# EAGLE design master_board_labrob (EAGLE 7.5.0)
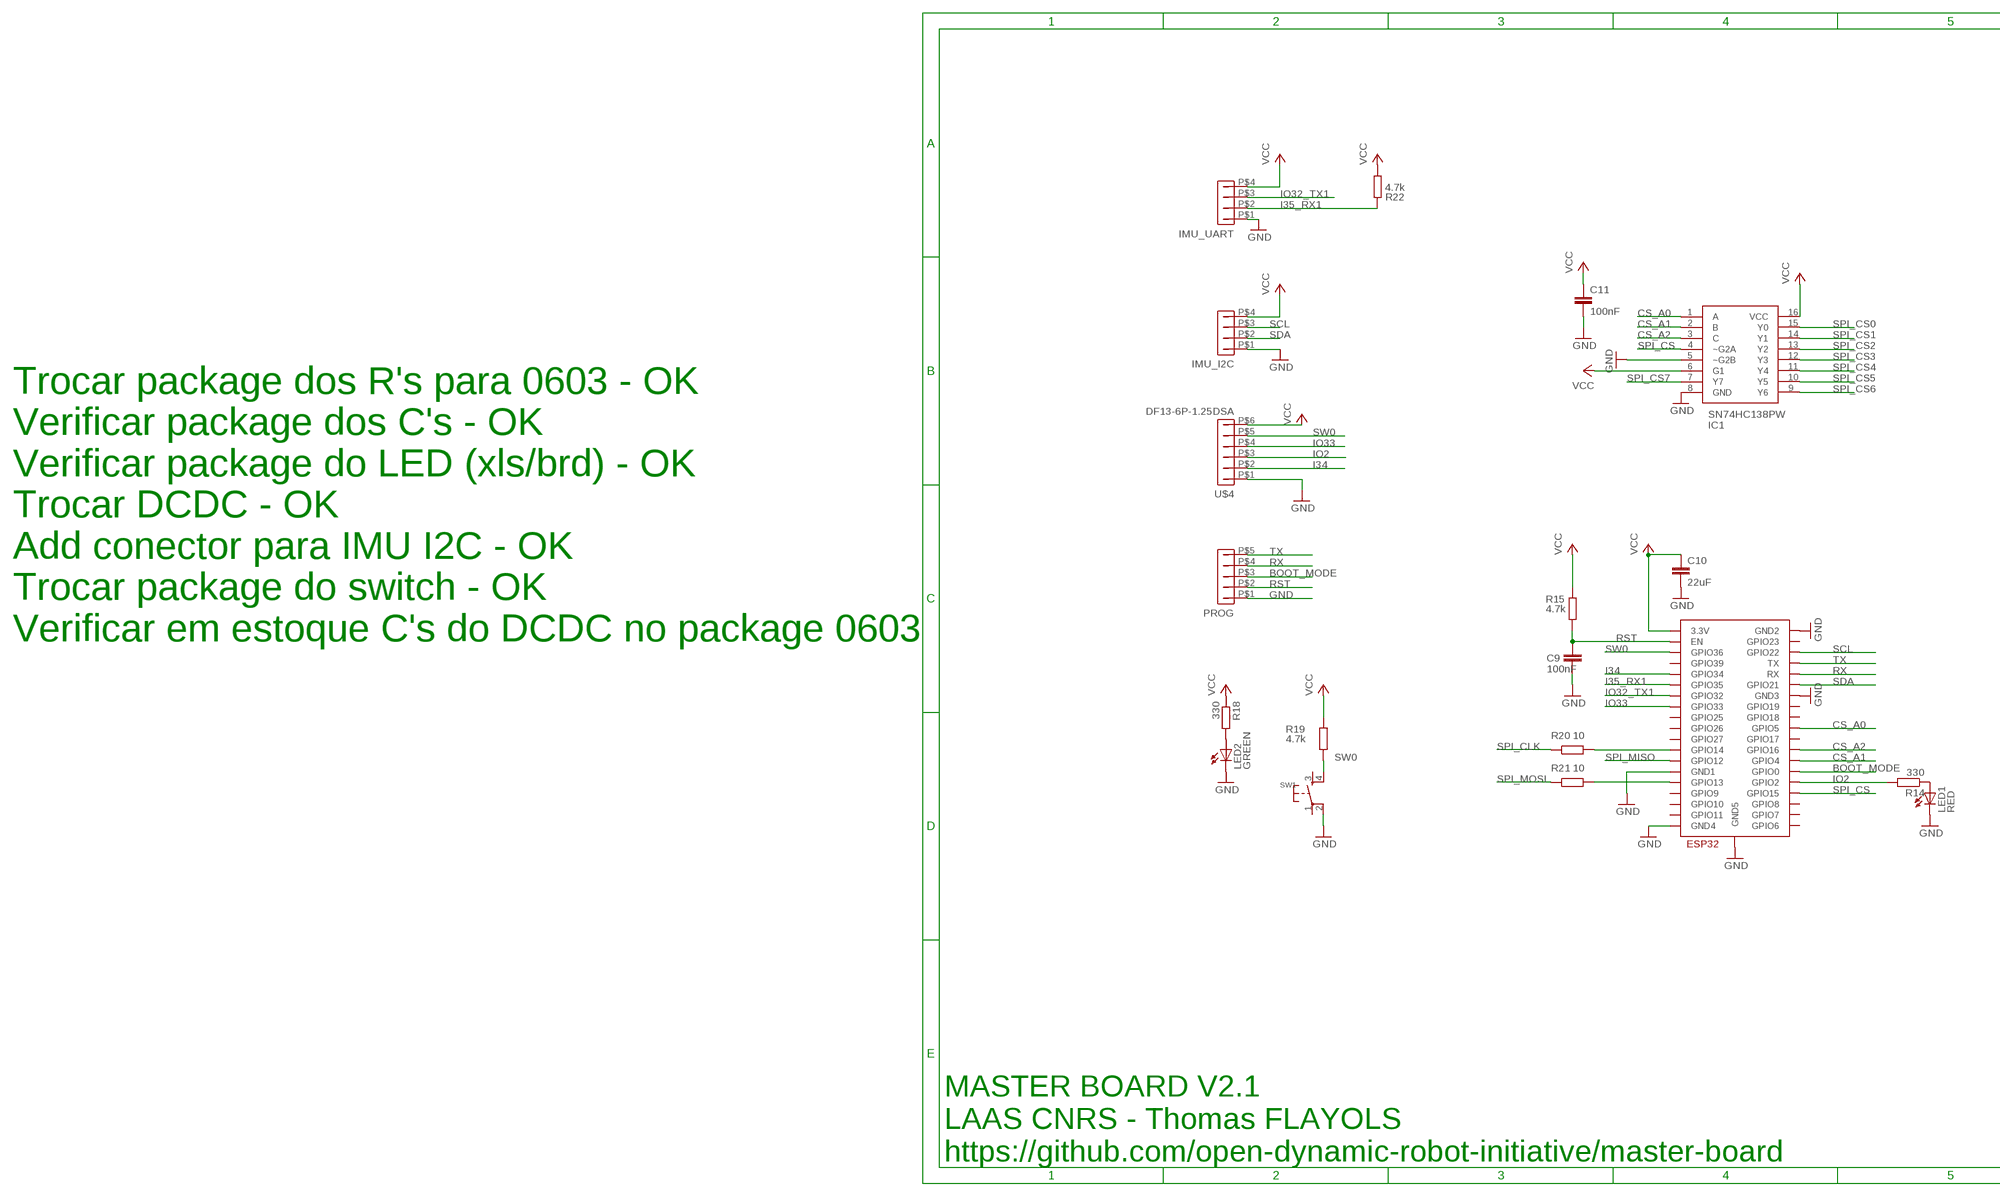
[diagram p0: schematic, sheet 1, part 1 of 2]
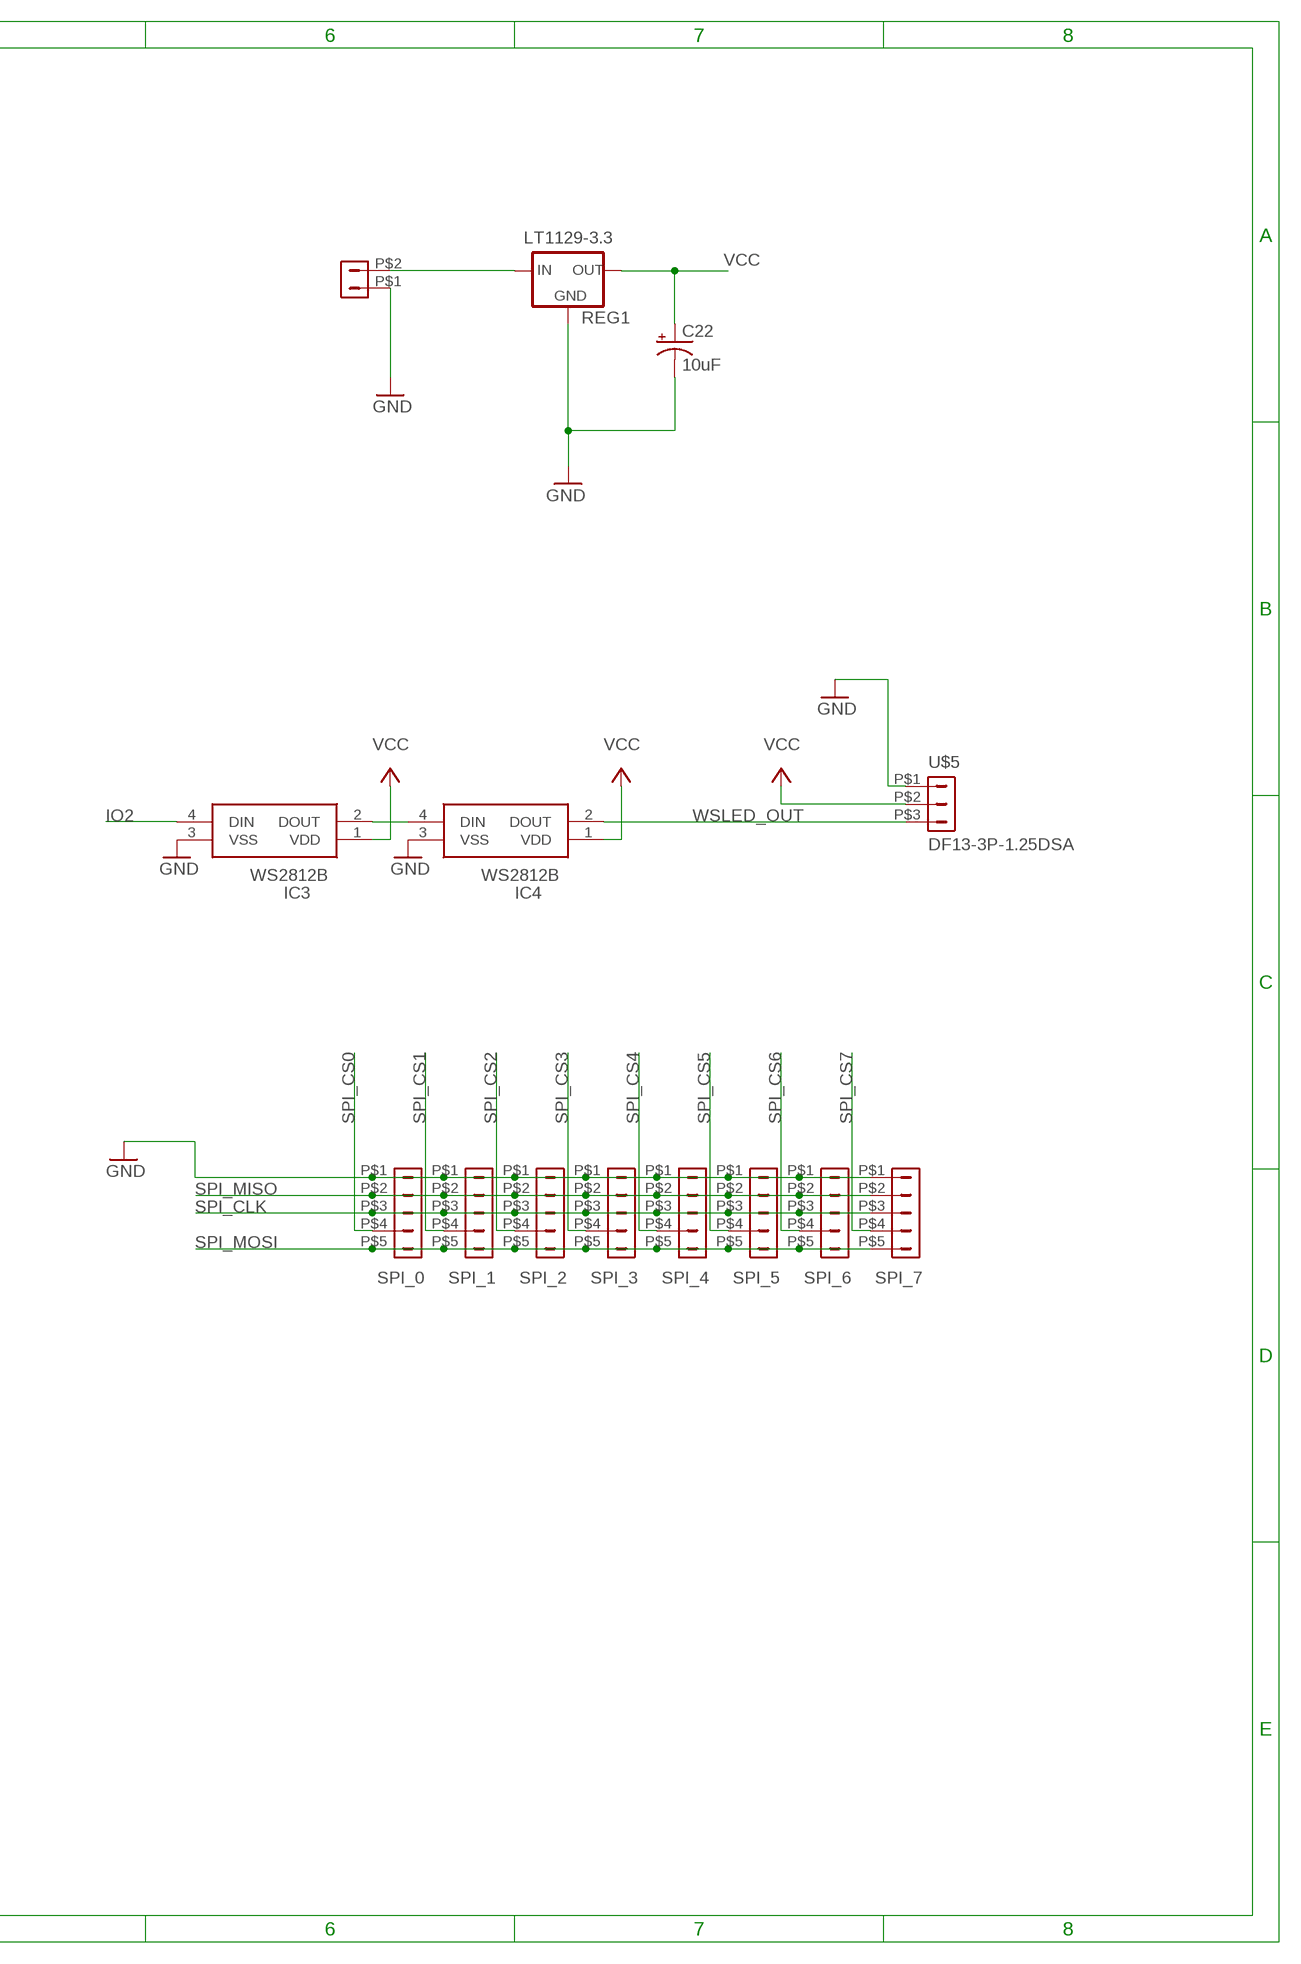
[diagram p1: schematic, sheet 1, part 2 of 2]

## Parts
C9  100nF  C-EUC0603  [C0603]
C10  22uF  C-EUC0805  [C0805]
C11  100nF  C-EUC0603  [C0603]
C22  10uF  CPOL-USC/6032-28R  [C/6032-28R]
IC1  SN74HC138PW  [SOP65P640X120-16N]
IC3  WS2812B  [WS2812B]
IC4  WS2812B  [WS2812B]
IMU_I2C  DF13-4P-1.25DSA  [DF13-4P-1.25DSA]
IMU_UART  DF13-4P-1.25DSA  [DF13-4P-1.25DSA]
LED1  RED  LEDCHIPLED_0603  [CHIPLED_0603]
LED2  GREEN  LEDCHIPLED_0603  [CHIPLED_0603]
POWER  DF13-2P-1.25DSA  [DF13-2P-1.25DSA]
PROG  DF13-5P-1.25DSA  [DF13-5P-1.25DSA]
R14  330  R-EU_R0603  [R0603]
R15  4.7k  R-EU_R0603  [R0603]
R18  330  R-EU_R0603  [R0603]
R19  4.7k  R-EU_R0603  [R0603]
R20  10  R-EU_R0603  [R0603]
R21  10  R-EU_R0603  [R0603]
R22  4.7k  R-EU_R0603  [R0603]
REG1  LT1129-3.3  [SOT223]
SPI_0  DF13-5P-1.25DSA  [DF13-5P-1.25DSA]
SPI_1  DF13-5P-1.25DSA  [DF13-5P-1.25DSA]
SPI_2  DF13-5P-1.25DSA  [DF13-5P-1.25DSA]
SPI_3  DF13-5P-1.25DSA  [DF13-5P-1.25DSA]
SPI_4  DF13-5P-1.25DSA  [DF13-5P-1.25DSA]
SPI_5  DF13-5P-1.25DSA  [DF13-5P-1.25DSA]
SPI_6  DF13-5P-1.25DSA  [DF13-5P-1.25DSA]
SPI_7  DF13-5P-1.25DSA  [DF13-5P-1.25DSA]
SW1  B3U-1000P-2P-SMD  DTSM-6  [DTSM-6]
U$1  ESP32-WROOM  [ESP32-WROOM]
U$4  DF13-6P-1.25DSA  [DF13-6P-1.25DSA]
U$5  DF13-3P-1.25DSA  [DF13-3P-1.25DSA]

## Nets
BOOT_MODE: PROG.P$3 U$1.IO0(GPIO0)
CS_A0: IC1.1(A) U$1.IO5(GPIO5)
CS_A1: IC1.2(B) U$1.IO4(GPIO4)
CS_A2: IC1.3(C) U$1.IO16(GPIO16)
GND: C9.2 C10.2 C11.2 C22.- IC1.5(~G2B) IC1.8(GND) IC3.3(VSS) IC4.3(VSS) IMU_I2C.P$1 IMU_UART.P$1 LED1.C LED2.C POWER.P$1 PROG.P$1 REG1.2(GND) REG1.TAB(GND) SPI_0.P$1 SPI_1.P$1 SPI_2.P$1 SPI_3.P$1 SPI_4.P$1 SPI_5.P$1 SPI_6.P$1 SPI_7.P$1 SW1.2 U$1.GND1 U$1.GND2 U$1.GND3 U$1.GND4 U$1.GND5 U$4.P$1 U$5.P$1
I34: U$1.IO34(GPIO34) U$4.P$2
I35_RX1: IMU_UART.P$2 R22.2 U$1.IO35(GPIO35)
IO2: IC3.4(DIN) R14.2 U$1.IO2(GPIO2) U$4.P$3
IO32_TX1: IMU_UART.P$3 U$1.IO32(GPIO32)
IO33: U$1.IO33(GPIO33) U$4.P$4
N$1: IC3.2(DOUT) IC4.4(DIN)
N$3: POWER.P$2 REG1.1(IN)
N$16: LED1.A R14.1
N$17: R21.2 U$1.IO13(GPIO13)
N$20: LED2.A R18.2
N$21: R20.2 U$1.IO14(GPIO14)
RST: C9.1 PROG.P$2 R15.1 U$1.EN
RX: PROG.P$4 U$1.RX
SCL: IMU_I2C.P$3 U$1.IO22(GPIO22)
SDA: IMU_I2C.P$2 U$1.IO21(GPIO21)
SPI_CLK: R20.1 SPI_0.P$3 SPI_1.P$3 SPI_2.P$3 SPI_3.P$3 SPI_4.P$3 SPI_5.P$3 SPI_6.P$3 SPI_7.P$3
SPI_CS: IC1.4(~G2A) U$1.IO15(GPIO15)
SPI_CS0: IC1.15(Y0) SPI_0.P$4
SPI_CS1: IC1.14(Y1) SPI_1.P$4
SPI_CS2: IC1.13(Y2) SPI_2.P$4
SPI_CS3: IC1.12(Y3) SPI_3.P$4
SPI_CS4: IC1.11(Y4) SPI_4.P$4
SPI_CS5: IC1.10(Y5) SPI_5.P$4
SPI_CS6: IC1.9(Y6) SPI_6.P$4
SPI_CS7: IC1.7(Y7) SPI_7.P$4
SPI_MISO: SPI_0.P$2 SPI_1.P$2 SPI_2.P$2 SPI_3.P$2 SPI_4.P$2 SPI_5.P$2 SPI_6.P$2 SPI_7.P$2 U$1.IO12(GPIO12)
SPI_MOSI: R21.1 SPI_0.P$5 SPI_1.P$5 SPI_2.P$5 SPI_3.P$5 SPI_4.P$5 SPI_5.P$5 SPI_6.P$5 SPI_7.P$5
SW0: R19.1 SW1.4 U$1.SENSOR_VP(GPIO36) U$4.P$5
TX: PROG.P$5 U$1.TX
VCC [power]: C10.1 C11.1 C22.+ IC1.6(G1) IC1.16(VCC) IC3.1(VDD) IC4.1(VDD) IMU_I2C.P$4 IMU_UART.P$4 R15.2 R18.1 R19.2 R22.1 REG1.3(OUT) U$1.3V3(3.3V) U$4.P$6 U$5.P$2
WSLED_OUT: IC4.2(DOUT) U$5.P$3
Unconnected: SW1.1 SW1.3 U$1.CLK(GPIO6) U$1.CMD(GPIO11) U$1.IO17(GPIO17) U$1.IO18(GPIO18) U$1.IO19(GPIO19) U$1.IO23(GPIO23) U$1.IO25(GPIO25) U$1.IO26(GPIO26) U$1.IO27(GPIO27) U$1.SD0(GPIO7) U$1.SD1(GPIO8) U$1.SD2(GPIO9) U$1.SD3(GPIO10) U$1.SENSOR_VN(GPIO39)

## Notes on the sheet
- Trocar package dos R's para 0603 - OK
  Verificar package dos C's - OK
  Verificar package do LED (xls/brd) - OK
  Trocar DCDC - OK
  Add conector para IMU I2C - OK
  Trocar package do switch - OK
  Verificar em estoque C's do DCDC no package 0603
- MASTER BOARD V2.1
  LAAS CNRS - Thomas FLAYOLS
  https://github.com/open-dynamic-robot-initiative/master-board

## Library data of the parts
C9 C11 = rcl:C-EU: CAPACITOR, European symbol; MANUFACTURER_PART_NUMBER: CPL-CAP-X7R-0402-100NF-16V
C10 = rcl:C-EU: CAPACITOR, European symbol; MANUFACTURER_PART_NUMBER: CPL-CAP-X5R-0805-22UF-6.3V
C22 = rcl:CPOL-US: POLARIZED CAPACITOR, American symbol
IC1 = SamacSys_Parts:SN74HC138PW: Texas Instruments SN74HC138PW, Decoder, Demultiplexer, 1-of-8, Inverting, 2 6 V, 16-Pin TSSOP Source: Datasheet <http://www.ti.com/lit/gpn/sn74hc138>; DESCRIPTION: Texas Instruments SN74HC138PW, Decoder, Demultiplexer, 1-of-8, Inverting, 2 6 V, 16-Pin TSSOP; HEIGHT: mm; MANUFACTURER_NAME: Texas Instruments; MANUFACTURER_PART_NUMBER: SN74HC138PW; RS_PART_NUMBER: 6631928; RS_PRICE-STOCK: https://uk.rs-online.com/web/p/products/6631928
IC3 IC4 = WS2812B:WS2812B: Intelligent control LED integrated light source Source: Datasheet <https://www.adafruit.com/datasheets/WS2812B.pdf>; DESCRIPTION: Intelligent control LED integrated light source; HEIGHT: mm; MANUFACTURER_NAME: Worldsemi; MANUFACTURER_PART_NUMBER: WS2812B
IMU_I2C IMU_UART = con-hirose-df13:DF13-4P-1.25: DF13-4P 1.25mm Pitch Miniature Crimping Connector.; MANUFACTURER_PART_NUMBER: DF13-4P-1.25DSA
LED1 = led:LED: LED OSRAM: - CHIPLED LG R971, LG N971, LY N971, LG Q971, LY Q971, LO R971, LY R971 LH N974, LH R974 LS Q976, LO Q976, LY Q976 LO Q996 - Hyper CHIPLED LW Q18S LB Q993, LB Q99A, LB R99A - SideLED LS A670, LO A670, LY A670, LG A670, LP A670 LB A673, LV A673, LT A673, LW A673 LH A674 LY A675 LS A676, LA A676, LO A676, LY A676, LW A676 LS A679, LY A679, LG A679 - Hyper Micro SIDELED® LS Y876, LA Y876, LO Y876, LY Y876 LT Y87S - SmartLED LW L88C, LW L88S LB L89C, LB L89S, LG L890 LS L89K, LO L89K, LY L89K LS L896, LA L896, LO L896, LY L896 - TOPLED LS T670, LO T670, LY T670, LG T670, LP T670 LSG T670, LSP T670, LSY T670, LOP T670, LYG T670 LG T671, LOG T671, LSG T671 LB T673, LV T673, LT T673, LW T673 LH T674 LS T676, LA T676, LO T676, LY T676, LB T676, LH T676, LSB T676, LW T676 LB T67C, LV T67C, LT T67C, LS T67K, LO T67K, LY T67K, LW E67C LS E67B, LA E67B, LO E67B, LY E67B, LB E67C, LV E67C, LT E67C LW T67C LS T679, LY T679, LG T679 LS T770, LO T770, LY T770, LG T770, LP T770 LB T773, LV T773, LT T773, LW T773 LH T774 LS E675, LA E675, LY E675, LS T675 LS T776, LA T776, LO T776, LY T776, LB T776 LHGB T686 LT T68C, LB T68C - Hyper Mini TOPLED® LB M676 - Mini TOPLED Santana® LG M470 LS M47K, LO M47K, LY M47K Source: http://www.osram.convergy.de LUXEON: - LUMILED® LXK2-PW12-R00, LXK2-PW12-S00, LXK2-PW14-U00, LXK2-PW14-V00 LXK2-PM12-R00, LXK2-PM12-S00, LXK2-PM14-U00 LXK2-PE12-Q00, LXK2-PE12-R00, LXK2-PE12-S00, LXK2-PE14-T00, LXK2-PE14-U00 LXK2-PB12-K00, LXK2-PB12-L00, LXK2-PB12-M00, LXK2-PB14-N00, LXK2-PB14-P00, LXK2-PB14-Q00 LXK2-PR12-L00, LXK2-PR12-M00, LXK2-PR14-Q00, LXK2-PR14-R00 LXK2-PD12-Q00, LXK2-PD12-R00, LXK2-PD12-S00 LXK2-PH12-R00, LXK2-PH12-S00 LXK2-PL12-P00, LXK2-PL12-Q00, LXK2-PL12-R00 Source: www.luxeon.com KINGBRIGHT: KA-3528ASYC Source: www.kingbright.com; MANUFACTURER_PART_NUMBER: CPL-LED-0603-RED
LED2 = led:LED: LED OSRAM: - CHIPLED LG R971, LG N971, LY N971, LG Q971, LY Q971, LO R971, LY R971 LH N974, LH R974 LS Q976, LO Q976, LY Q976 LO Q996 - Hyper CHIPLED LW Q18S LB Q993, LB Q99A, LB R99A - SideLED LS A670, LO A670, LY A670, LG A670, LP A670 LB A673, LV A673, LT A673, LW A673 LH A674 LY A675 LS A676, LA A676, LO A676, LY A676, LW A676 LS A679, LY A679, LG A679 - Hyper Micro SIDELED® LS Y876, LA Y876, LO Y876, LY Y876 LT Y87S - SmartLED LW L88C, LW L88S LB L89C, LB L89S, LG L890 LS L89K, LO L89K, LY L89K LS L896, LA L896, LO L896, LY L896 - TOPLED LS T670, LO T670, LY T670, LG T670, LP T670 LSG T670, LSP T670, LSY T670, LOP T670, LYG T670 LG T671, LOG T671, LSG T671 LB T673, LV T673, LT T673, LW T673 LH T674 LS T676, LA T676, LO T676, LY T676, LB T676, LH T676, LSB T676, LW T676 LB T67C, LV T67C, LT T67C, LS T67K, LO T67K, LY T67K, LW E67C LS E67B, LA E67B, LO E67B, LY E67B, LB E67C, LV E67C, LT E67C LW T67C LS T679, LY T679, LG T679 LS T770, LO T770, LY T770, LG T770, LP T770 LB T773, LV T773, LT T773, LW T773 LH T774 LS E675, LA E675, LY E675, LS T675 LS T776, LA T776, LO T776, LY T776, LB T776 LHGB T686 LT T68C, LB T68C - Hyper Mini TOPLED® LB M676 - Mini TOPLED Santana® LG M470 LS M47K, LO M47K, LY M47K Source: http://www.osram.convergy.de LUXEON: - LUMILED® LXK2-PW12-R00, LXK2-PW12-S00, LXK2-PW14-U00, LXK2-PW14-V00 LXK2-PM12-R00, LXK2-PM12-S00, LXK2-PM14-U00 LXK2-PE12-Q00, LXK2-PE12-R00, LXK2-PE12-S00, LXK2-PE14-T00, LXK2-PE14-U00 LXK2-PB12-K00, LXK2-PB12-L00, LXK2-PB12-M00, LXK2-PB14-N00, LXK2-PB14-P00, LXK2-PB14-Q00 LXK2-PR12-L00, LXK2-PR12-M00, LXK2-PR14-Q00, LXK2-PR14-R00 LXK2-PD12-Q00, LXK2-PD12-R00, LXK2-PD12-S00 LXK2-PH12-R00, LXK2-PH12-S00 LXK2-PL12-P00, LXK2-PL12-Q00, LXK2-PL12-R00 Source: www.luxeon.com KINGBRIGHT: KA-3528ASYC Source: www.kingbright.com; MANUFACTURER_PART_NUMBER: CPL-LED-0603-GREEN
POWER = con-hirose-df13:DF13-2P-1.25: DF13-2P 1.25mm Pitch Miniature Crimping Connector.; MANUFACTURER_PART_NUMBER: DF13-3P-1.25DSA
PROG SPI_0 SPI_1-SPI_7 = con-hirose-df13:DF13-5P-1.25: DF13-5P 1.25mm Pitch Miniature Crimping Connector.; MANUFACTURER_PART_NUMBER: DF13-5P-1.25DSA
R14 R18 = rcl:R-EU_: RESISTOR, European symbol; MANUFACTURER_PART_NUMBER: RC0402JR-13330RL
R15 R19 R22 = rcl:R-EU_: RESISTOR, European symbol; MANUFACTURER_PART_NUMBER: CPL-RES-0402-4.7K-0.063W
R20 R21 = rcl:R-EU_: RESISTOR, European symbol; MANUFACTURER_PART_NUMBER: CPL-RES-0402-10-0.063W
REG1 = v-reg-linear:LT1129-3.3
SW1 = switch-tact:DTSM-6; MANUFACTURER_PART_NUMBER: B3U-1000P
U$1 = ESP32:ESP32-WROOM; MANUFACTURER_PART_NUMBER: ESP32-WROOM-32D
U$4 = con-hirose-df13:DF13-6P-1.25: DF13-6P 1.25mm Pitch Miniature Crimping Connector.; MANUFACTURER_PART_NUMBER: DF13-6P-1.25DSA
U$5 = con-hirose-df13:DF13-3P-1.25: DF13-3P 1.25mm Pitch Miniature Crimping Connector.; MANUFACTURER_PART_NUMBER: DF13-3P-1.25DSA

## Net classes
1 power: width 0.406 mm

## Board
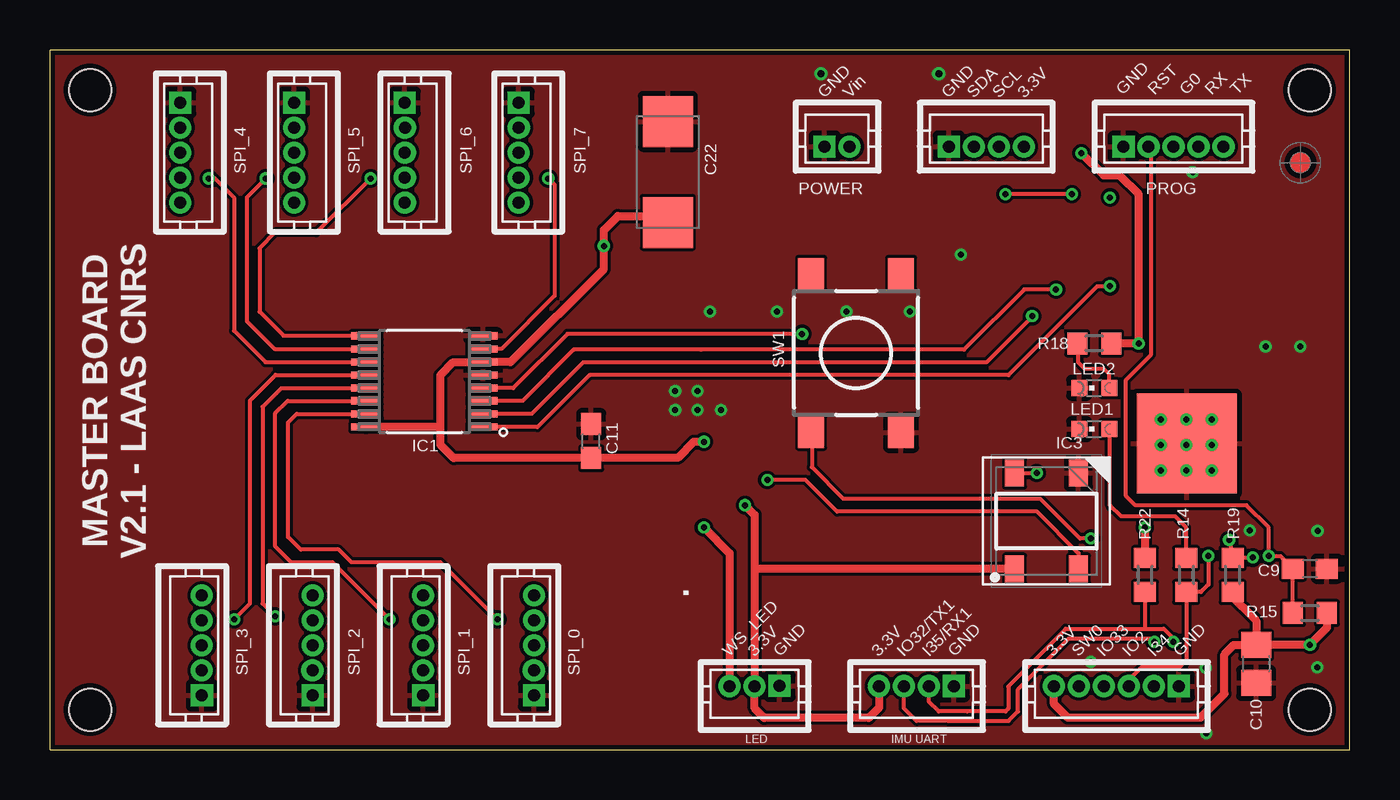
[diagram p2: board, top side]
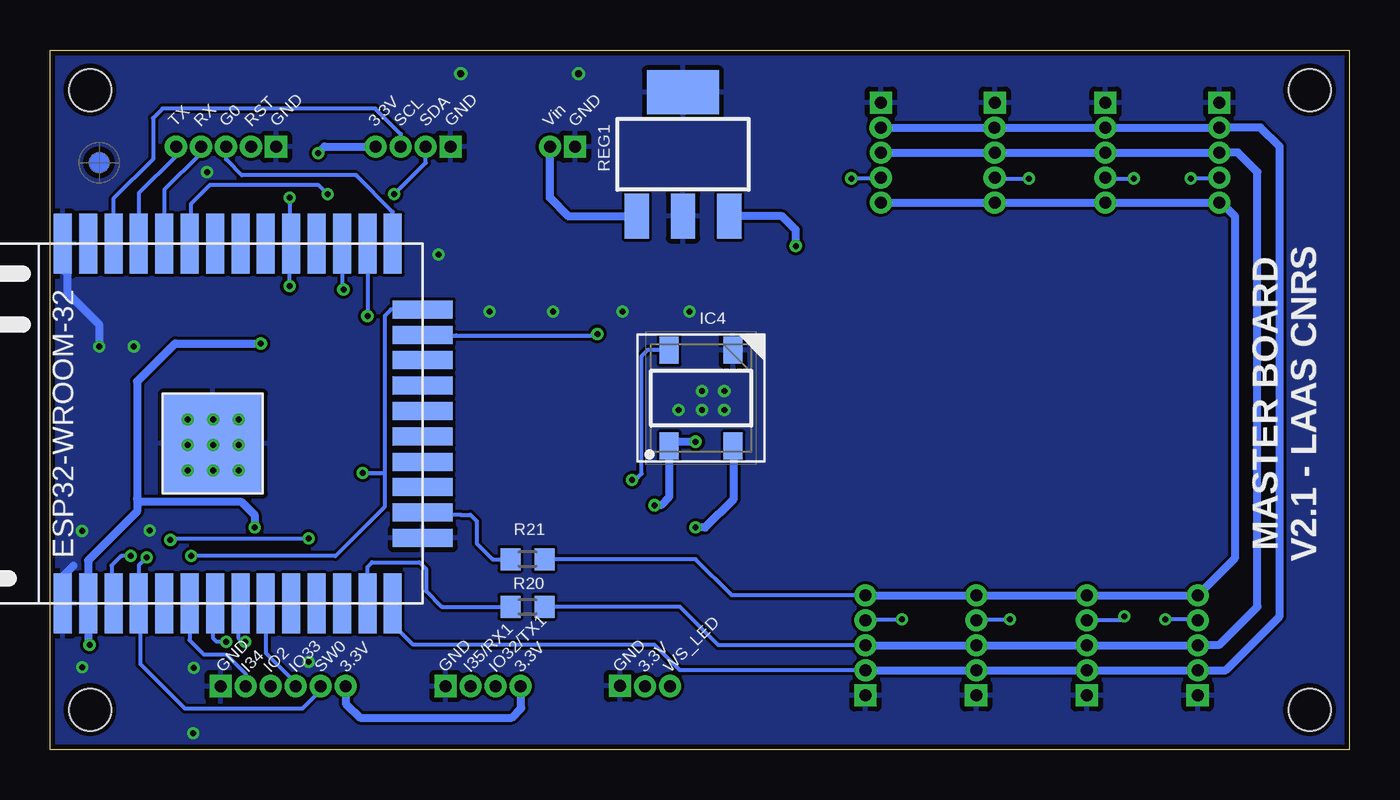
[diagram p3: board, bottom side, seen from below]

Size 65 x 35 mm. Coordinates in mm from the lower left corner, seen from the top.
Outline: 0,35 65,35 65,0 0,0 0,35
Copper layers (1*16): Top 0.035mm / dielectric 1.5mm / Bottom 0.035mm
Design rules "SeeedStudio": minimum track width 6mil, minimum drill 12mil, track to track 6mil, track to pad 6mil, pad to pad 6mil, via to via 6mil, smd to smd 0mil, copper to edge 10mil, drill to drill 10mil, minimum pad ring 10mil, minimum via ring 6mil, stop-mask expansion 2mil, vias tented up to drill 100mil, thermal gap 10mil
Holes 2.1 mm at 2,33 2,2 63,2 63,33

### Footprints (pad centres in the part's own frame; a part is rotated, then mirrored left to right if it is on the bottom)
C0603 = smd 1.1 x 1: 1 -0.85,0; 2 0.85,0
C0805 = smd 1.3 x 1.5: 1 -0.95,0; 2 0.95,0
C/6032-28R = smd 2.55 x 2.5: + 2.525,0; - -2.525,0
SOP65P640X120-16N = smd 1.473 x 0.356: 1 -2.921,2.286; 2 -2.921,1.626; 3 -2.921,0.965; 4 -2.921,0.33; 5 -2.921,-0.33; 6 -2.921,-0.965; 7 -2.921,-1.626; 8 -2.921,-2.286; 9 2.921,-2.286; 10 2.921,-1.626; 11 2.921,-0.965; 12 2.921,-0.33; 13 2.921,0.33; 14 2.921,0.965; 15 2.921,1.626; 16 2.921,2.286
WS2812B = smd 1.35 x 0.95: 1 -2.4,1.6; 2 -2.4,-1.6; 3 2.4,-1.6; 4 2.4,1.6
DF13-4P-1.25DSA = drill 0.6 pad 1.016 square: P$1 1.875,0 | drill 0.6 pad 1.016: P$2 0.625,0; P$3 -0.625,0; P$4 -1.875,0
CHIPLED_0603 = smd 0.8 x 0.8: A 0,-0.75; C 0,0.75
DF13-2P-1.25DSA = drill 0.6 pad 1.016 square: P$1 0.625,0 | drill 0.6 pad 1.016: P$2 -0.625,0
DF13-5P-1.25DSA = drill 0.6 pad 1.016 square: P$1 2.5,0.005 | drill 0.6 pad 1.016: P$2 1.25,-0.005; P$3 0,0; P$4 -1.25,0; P$5 -2.5,0
R0603 = smd 1 x 1.1: 1 -0.85,0; 2 0.85,0
SOT223 = smd 1.219 x 2.235: 1 -2.311,-3.099; 2 0,-3.099; 3 2.311,-3.099 | smd 3.6 x 2.2: TAB 0,3.099
DTSM-6 = smd 1.55 x 1.3: 1 -3.975,2.25; 2 3.975,2.25; 3 -3.975,-2.25; 4 3.975,-2.25
ESP32-WROOM = smd 3 x 0.9: 3V3 0,16.74; EN 0,15.47; GND1 0,18.01; GND3 18,18.01; IO0 18,1.5; IO4 18,2.77; IO5 18,6.58; IO12 0,1.5; IO14 0,2.77; IO16 18,4.04; IO17 18,5.31; IO18 18,7.85; IO19 18,9.12; IO21 18,11.66; IO22 18,15.47; IO23 18,16.74; IO25 0,6.58; IO26 0,5.31; IO27 0,4.04; IO32 0,9.12; IO33 0,7.85; IO34 0,11.66; IO35 0,10.39; NC 18,10.39; RX 18,12.93; SENSOR_VN 0,12.93; SENSOR_VP 0,14.2; TX 18,14.2 | smd 0.9 x 3: CLK 9.635,0; CMD 8.365,0; GND2 3.285,0; IO2 14.715,0; IO13 4.555,0; IO15 13.445,0; SD0 10.905,0; SD1 12.175,0; SD2 5.825,0; SD3 7.095,0 | smd 5 x 5: GND4 8,10.5 | smd 5 x 5 bottom: GND5 8,10.5
DF13-6P-1.25DSA = drill 0.6 pad 1.016 square: P$1 3.125,0 | drill 0.6 pad 1.016: P$2 1.875,0; P$3 0.625,0; P$4 -0.625,0; P$5 -1.875,0; P$6 -3.125,0
DF13-3P-1.25DSA = drill 0.6 pad 1.016 square: P$1 1.25,0.005 | drill 0.6 pad 1.016: P$2 0,-0.005; P$3 -1.25,0

### Placement (x,y rotation side)
C9  63.02,9.05 0 top
C10  60.33,4.29 270 top
C11  27.07,15.43 90 top
C22  30.9,28.9 270 top
IC1  18.73,18.41 180 top
IC3  49.85,11.43 90 top
IC4  32.43,17.58 90 bottom
IMU_I2C  46.83,30.16 180 top
IMU_UART  43.34,3.17 0 top
LED1  52.23,16.03 90 top
LED2  52.23,18.1 90 top
POWER  39.37,30.16 180 top
PROG  56.2,30.16 180 top
R14  56.83,8.73 270 top
R15  63.02,6.83 0 top
R18  52.23,20.32 180 top
R19  59.16,8.73 270 top
R20  41.12,7.14 180 bottom
R21  41.12,9.53 180 bottom
R22  54.77,8.73 270 top
REF2  [VISION_REF10]  62.55,29.37 0 bottom
REF4  [VISION_REF10]  62.55,29.37 0 top
REG1  33.34,29.78 0 bottom
SPI_0  24.21,5.21 270 top
SPI_1  18.67,5.21 270 top
SPI_2  13.13,5.21 270 top
SPI_3  7.59,5.21 270 top
SPI_4  6.52,29.87 90 top
SPI_5  12.21,29.87 90 top
SPI_6  17.75,29.87 90 top
SPI_7  23.44,29.87 90 top
SW1  40.32,19.84 270 top
U$1  46.35,7.3 90 bottom
U$4  53.34,3.17 0 top
U$5  35.24,3.17 0 top

### Tracks (layer width: path | path; a pad name or v marks a point on that pad's centre or on a via)
BOOT_MODE
  Bottom 0.203: PROG.P$3 56.2,29.53 55.4,28.73 49.69,28.73 47.85,26.9 U$1.IO0
CS_A0  (via drill 0.3)
  Top 0.2: IC1.1 24.38,16.13 26.99,18.73 47.94,18.73 52.39,23.18
  Top 0.203: 52.39,23.18 v53.02,23.18
  Bottom 0.203: v53.02,27.62 53.02,25.39 U$1.IO5 53.02,25.21 v53.02,23.18
CS_A1  (via drill 0.3)
  Top 0.2: IC1.2 24.09,16.79 26.67,19.37 46.83,19.37 49.12,21.66 v49.12,21.68
  Bottom 0.203: U$1.IO4 v49.12,21.68
CS_A2  (via drill 0.3)
  Top 0.2: IC1.3 23.64,17.45 26.19,20 32.54,20 32.56,19.99 32.57,20 45.72,20 48.74,23.02 v50.32,23.02
  Bottom 0.203: U$1.IO16 50.4,23.09 v50.32,23.02
GND  (via drill 0.3, 0.35)
  Bottom 0.203: U$1.GND1 64.36,8.66 | U$1.GND3 64.36,24.04 | U$1.GND4 56.9,15.3 v58.1,16.51 | U$1.GND4 55.65,16.51 v55.56,16.51 | U$1.GND4 55.56,14.01 v55.56,13.97 | U$1.GND4 58.1,14.05 v58.1,13.97
  Bottom 0.406: 64.36,8.66 63.82,9.21 | 64.36,24.04 64.14,23.81 64.14,22.86 62.55,21.27 v62.55,20.16
  other vias: 56.83,15.24 56.83,16.51 55.56,15.24 56.83,13.97 58.1,15.24 45.56,24.77 63.4,10.93 57.15,28.89 32.38,17.94 44.45,33.81 31.27,16.99 60.01,10.95 31.27,17.94 33.02,21.91 32.38,16.99 33.55,16.99 52.06,4.4 57.83,0.8 60.8,20.16 38.57,33.81 57.82,4.1 36.35,21.91 39.85,21.91 43.02,21.91 63.39,4.12
  pour Top: 0,35 65,35 65,0 0,0
  pour Bottom: 0,35 65,35 65,0 0,0
I34
  Bottom 0.2: 56.67,4.76 56.2,4.76 55.22,3.78 U$4.P$2
  Bottom 0.203: U$1.IO34 58.02,5.47 57.31,4.76 56.67,4.76 | 55.22,3.3 U$4.P$2
I35_RX1  (via drill 0.3)
  Top 0.2: 50.81,6.04 54.77,6.04 | 54.77,6.04 55.71,6.04 56.2,5.56 v56.2,5.4 | R22.2 54.77,6.04 | 45.88,1.91 44.45,1.91 43.97,2.38 43.97,2.85 IMU_UART.P$2
  Top 0.203: 45.88,1.91 47.79,1.91 47.93,2.04 47.93,3.16 50.81,6.04
  Bottom 0.2: v56.2,5.4 56.67,5.4 56.83,5.56 56.83,7.21 U$1.IO35
IO2  (via drill 0.3)
  Top 0.2: 54.61,4.13 56.52,4.13 56.83,4.45 R14.2 57.57,7.88 57.94,8.26 v57.94,9.68 | IC3.4 v49.35,13.83
  Top 0.203: 54.61,4.13 53.97,3.48 U$4.P$3
  Bottom 0.2: 48.26,16.03 48.26,13.81 | 48.26,13.81 48.26,12.14 50.72,9.68 v57.94,9.68 | v49.35,13.83 48.28,13.83 48.26,13.81
  Bottom 0.203: U$1.IO2 47.94,22.02 48.26,21.7 48.26,16.03
IO32_TX1  (via drill 0.3)
  Top 0.2: 50.96,5.56 55.09,5.56 v55.24,5.4 | 44.93,1.43 43.34,1.43 42.7,2.06 42.7,2.85 IMU_UART.P$3
  Top 0.203: 44.93,1.43 47.94,1.43 48.42,1.91 48.42,3.02 50.96,5.56
  Bottom 0.2: v55.24,5.4 55.4,5.4 55.56,5.56 55.56,7.21 U$1.IO32
IO33
  Bottom 0.203: U$1.IO33 54.2,4.83 52.72,3.34 U$4.P$4
N$1  (via drill 0.3)
  Top 0.2: v35.88,13.49 37.78,13.49 39.37,11.91 49.37,11.91 51.45,9.82 IC3.2
  Bottom 0.2: v35.88,13.49 35.72,13.49 35.4,13.81 35.4,19.68 35.08,20 34.05,20 IC4.4
N$3
  Bottom 0.406: REG1.1 35.66,26.67 39.05,26.67 39.99,27.61 POWER.P$2
N$16
  Top 0.2: LED1.A 53.02,15.99 53.02,12.22 53.58,11.67 56.28,11.67 56.83,11.11 R14.1
N$17
  Bottom 0.2: 44.45,11.75 43.97,11.75 43.66,11.43 43.66,10.32 42.86,9.53 R21.2
  Bottom 0.203: 44.45,11.75 46.24,11.75 U$1.IO13
N$20
  Top 0.2: LED2.A 52.98,18.78 52.7,19.05 51.75,19.05 51.44,19.37 51.44,20.26 R18.2
N$21
  Bottom 0.2: 49.12,8.66 49.12,9.14 48.9,9.37 46.51,9.37 46.2,9.05 46.2,7.94 45.4,7.14 R20.2
  Bottom 0.203: 49.12,8.66 U$1.IO14
RST  (via drill 0.3)
  Top 0.2: R15.1 C9.1 61.54,9.68 v60.96,9.68 60.96,11.11 59.85,12.22 54.29,12.22 53.82,12.7 53.82,18.49 55.09,19.76 55.09,30.03 PROG.P$2
  Bottom 0.2: v60.96,9.68 61.44,9.68 61.91,9.21
  Bottom 0.203: 61.91,9.21 61.91,7.39
  Bottom 0.406: U$1.EN 61.91,7.39
RX
  Bottom 0.203: PROG.P$4 57.45,29.84 59.28,28.01 U$1.RX
SCL
  Bottom 0.2: U$1.IO22 61.83,27.55 59.85,29.53 59.85,31.59 59.37,32.07 48.74,32.07 47.46,30.79 IMU_I2C.P$3
SDA  (via drill 0.3)
  Top 0.2: v51.12,27.78 v47.78,27.78
  Bottom 0.2: U$1.IO21 57.94,25.37 57.94,27.3 56.99,28.26 51.59,28.26 v51.12,27.78 | v47.78,27.78 46.21,29.36 IMU_I2C.P$2
SPI_CLK
  Bottom 0.2: SPI_0.P$3 31.57,5.21 33.5,7.14 R20.1
  Bottom 0.406: SPI_7.P$3 SPI_6.P$3 SPI_5.P$3 SPI_4.P$3 5.58,29.87 4.6,28.89 4.6,7.14 6.51,5.24 7.57,5.24 SPI_3.P$3 SPI_2.P$3 SPI_1.P$3 SPI_0.P$3
SPI_CS  (via drill 0.3)
  Top 0.2: IC1.4 23.16,18.09 25.88,20.8 v37.62,20.8
  Bottom 0.2: 44.66,20.72 37.7,20.72 v37.62,20.8
  Bottom 0.203: U$1.IO15 46.32,20.72 44.66,20.72
SPI_CS0  (via drill 0.3)
  Top 0.2: IC1.15 12.34,16.79 11.91,16.35 11.91,10.64 12.54,10 14.45,10 15.08,9.37 19.53,9.37 v22.38,6.51
  Bottom 0.2: SPI_0.P$4 24.16,6.51 v22.38,6.51
SPI_CS1  (via drill 0.3)
  Top 0.2: IC1.14 11.89,17.45 11.27,16.83 11.27,10.16 12.06,9.37 14.13,9.37 v16.99,6.51
  Bottom 0.2: SPI_1.P$4 18.62,6.51 v16.99,6.51
SPI_CS2  (via drill 0.3)
  Top 0.2: IC1.13 11.58,18.09 10.64,17.14 10.64,7.3 v11.27,6.67
  Bottom 0.2: 13.18,6.51 SPI_2.P$4 11.47,6.46 v11.27,6.67
SPI_CS3  (via drill 0.3)
  Top 0.2: v9.21,6.51 10,7.3 10,17.46 11.28,18.75 IC1.12
  Bottom 0.2: SPI_3.P$4 7.64,6.51 v9.21,6.51
SPI_CS4  (via drill 0.3)
  Top 0.2: v7.94,28.57 8.26,28.57 9.21,27.62 9.21,20.95 10.78,19.38 IC1.11
  Bottom 0.2: SPI_4.P$4 6.56,28.57 v7.94,28.57
SPI_CS5  (via drill 0.3)
  Top 0.2: v10.79,28.57 9.84,27.62 9.84,21.43 11.23,20.04 IC1.10
  Bottom 0.2: SPI_5.P$4 12.17,28.57 v10.79,28.57
SPI_CS6  (via drill 0.3)
  Top 0.2: IC1.9 11.68,20.7 10.48,21.91 10.48,25.08 11.27,25.88 13.34,25.88 v16.03,28.57
  Bottom 0.2: SPI_6.P$4 17.7,28.57 v16.03,28.57
SPI_CS7  (via drill 0.3)
  Top 0.2: v24.92,28.57 25.24,28.26 25.24,22.7 22.58,20.04 IC1.7
  Bottom 0.2: SPI_7.P$4 23.49,28.57 v24.92,28.57
SPI_MISO
  Bottom 0.2: SPI_0.P$2 33.49,3.96 34.77,5.24 46.83,5.24 47.78,6.19 47.78,7.23 U$1.IO12
  Bottom 0.406: SPI_7.P$2 SPI_6.P$2 SPI_5.P$2 SPI_4.P$2 4.45,31.12 3.49,30.16 3.49,6.67 6.19,3.97 SPI_3.P$2 SPI_2.P$2 SPI_1.P$2 SPI_0.P$2
SPI_MOSI
  Bottom 0.2: SPI_0.P$5 30.89,7.71 32.7,9.53 R21.1
  Bottom 0.406: SPI_7.P$5 SPI_6.P$5 SPI_5.P$5 SPI_4.P$5 6.42,27.37 5.71,26.67 5.71,9.59 SPI_3.P$5 SPI_2.P$5 SPI_1.P$5 SPI_0.P$5
SW0  (via drill 0.3)
  Top 0.2: SW1.4 38.1,15.84 38.1,14.13 39.69,12.54 49.53,12.54 51.51,10.56 v52.07,10.56 | v58.98,10.48 59,10.46 R19.1 59.18,9.6 v60.17,9.6
  Bottom 0.2: 60.55,8.66 60.55,9.22 v60.17,9.6 | v58.98,10.48 58.9,10.56 v52.07,10.56
  Bottom 0.203: 60.55,8.66 U$1.SENSOR_VP 60.48,7.23 60.48,4.29 58.25,2.05 52.38,2.05 51.57,2.86 U$4.P$5
TX
  Bottom 0.203: PROG.P$5 58.7,29.69 60.55,27.83 U$1.TX
VCC  (via drill 0.3)
  Top 0.406: 19.53,16.19 19.53,15.24 20.19,14.58 C11.1 27.1,14.6 31.4,14.6 32.2,15.4 v32.7,15.4 | 19.53,16.19 19.46,16.13 IC1.16 | 19.53,16.19 19.53,18.73 20.17,19.38 IC1.6 23.03,19.38 27.7,24.05 v27.7,25.2 27.7,26 28.4,26.7 30.3,26.7 30.62,26.38 C22.+ | R15.2 63.87,6.09 v63.02,5.24 C10.1 | C10.1 60.33,6.45 59,7.78 R19.2 | C10.1 59.21,5.24 58.74,4.76 58.74,2.79 57.54,1.6 50.9,1.6 50.22,2.29 U$4.P$6 | v51.59,29.84 52.7,28.73 53.5,28.73 54.45,27.78 v54.45,20.32 R18.1 | IC3.1 48.23,9.05 35.24,9.05 | v54.77,11.11 R22.1 | v34.77,12.22 35.24,11.75 35.24,9.05 | 35.24,9.05 U$5.P$2 35.24,2.06 35.72,1.59 40.96,1.59 41.46,2.09 IMU_UART.P$4
  Bottom 0.406: 60.64,12.54 60.64,18.41 58.74,20.32 v54.45,20.32 | 60.64,12.54 60.64,11.91 63.09,9.45 U$1.3V3 63.09,5.31 v63.02,5.24 | v32.7,15.4 33.81,15.4 IC4.1 34.03,12.64 34.45,12.22 v34.77,12.22 | 60.64,12.54 60.48,12.38 55.4,12.38 54.77,11.75 v54.77,11.11 | v51.59,29.84 51.28,30.16 IMU_I2C.P$4 | v27.7,25.2 27.7,26 28.39,26.68 REG1.3 | U$4.P$6 50.2,2.84 50.2,2.3 49.5,1.6 41.9,1.6 41.43,2.06 41.43,2.83 IMU_UART.P$4
WSLED_OUT  (via drill 0.3)
  Top 0.406: v32.7,11.11 33.99,9.82 U$5.P$3
  Bottom 0.406: IC4.2 30.8,15.15 30.8,12.54 32.23,11.11 v32.7,11.11

### Text on the board
tPlace: GND | Vin | GND | SDA | SCL | 3.3V | GND | RST | G0 | RX | TX | SPI_4 | SPI_5 | SPI_6 | SPI_7 | MASTER BOARD / V2.1 - LAAS CNRS | WS_LED | 3.3V | GND | 3.3V | IO32/TX1 | I35/RX1 | GND | 3.3V | SW0 | IO33 | IO2 | I34 | GND | SPI_3 | SPI_2 | SPI_1 | SPI_0 | LED | IMU UART
bPlace: GND | Vin | GND | SDA | SCL | 3.3V | GND | RST | G0 | RX | TX | MASTER BOARD / V2.1 - LAAS CNRS | WS_LED | 3.3V | GND | 3.3V | IO32/TX1 | I35/RX1 | GND | 3.3V | SW0 | IO33 | IO2 | I34 | GND
tNames: .